# Altium project datn.PrjPCB
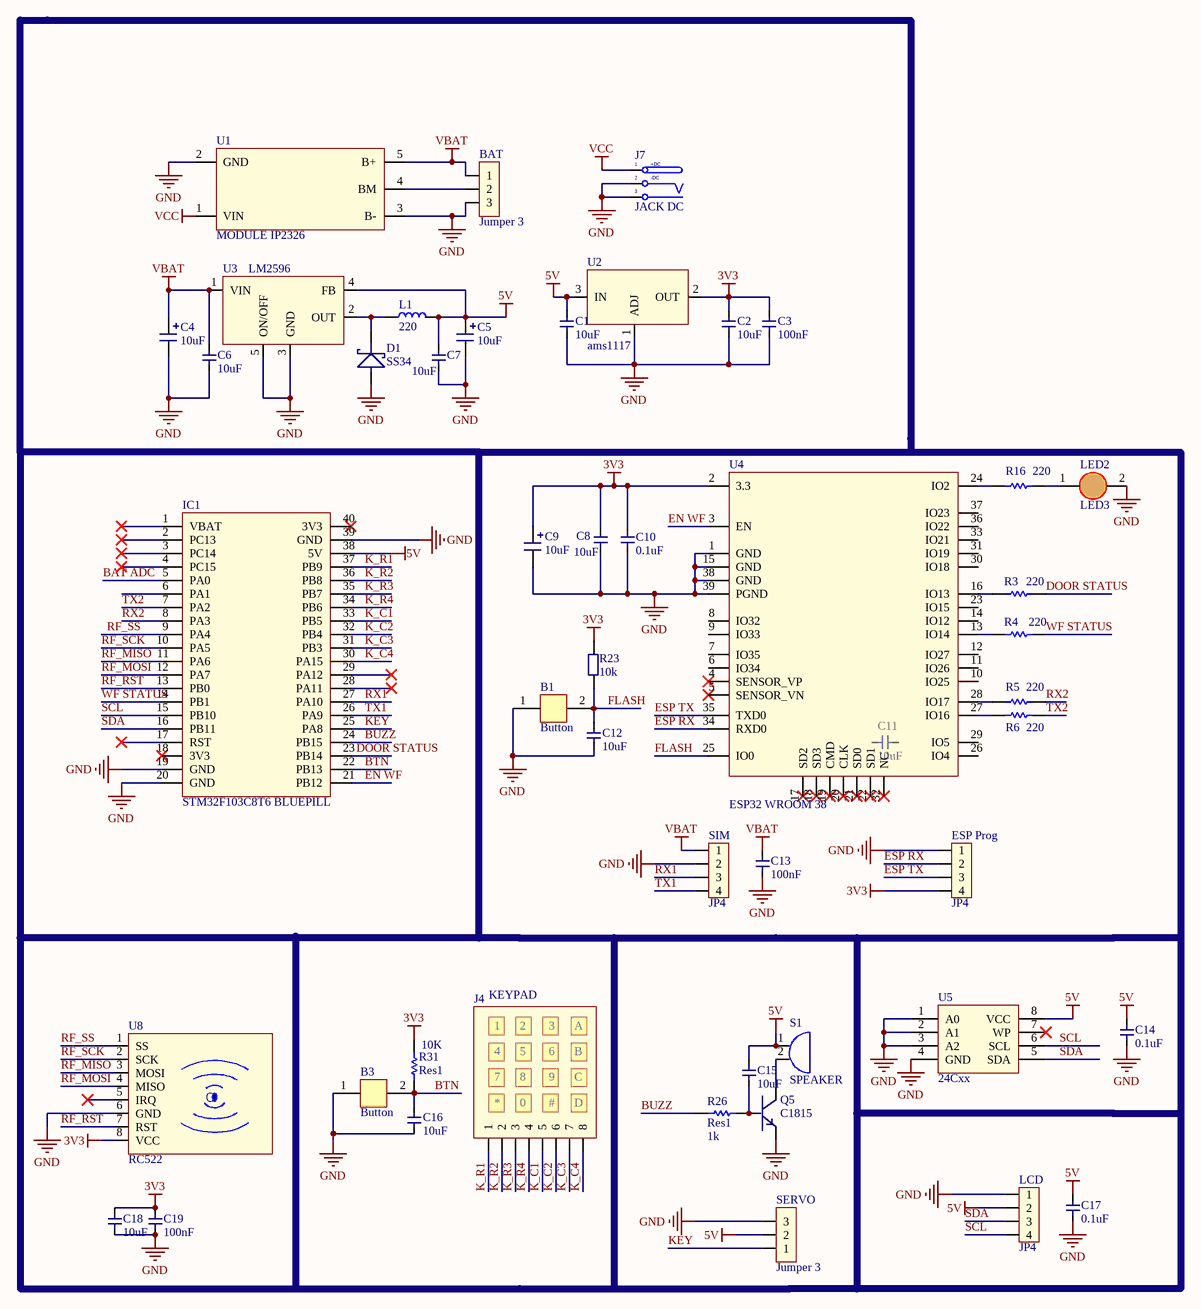
[diagram p0: nguyen_ly.SchDoc]
1 sheet, 48 parts. Net scope: global (net labels, ports and power ports of the same name join across sheets).
Board files: datn_pcb.PcbDoc, PCB1.PcbDoc, PCB2.PcbDoc

## Sheet nguyen_ly.SchDoc
size A3

### Parts
B1  Button  [Button 2 Pin]
B3  Button  [Button 2 Pin]
BAT  Jumper 3  [JP3]
C1  10uF  [cap 0805]
C2  10uF  [cap 0805]
C3  100nF  [cap 0805]
C4  10uF  [cap pol 63x54]
C5  10uF  [cap pol 63x54]
C6  10uF  [cap 0805]
C7  10uF  [cap 0805]
C8  10uF  [cap 0805]
C9  10uF  [cap pol 63x54]
C10  0.1uF  [cap 0805]
C11  10uF  [cap 0805]
C12  10uF  [cap 0805]
C13  100nF  [cap 0805]
C14  0.1uF  [cap 0805]
C15  10uF  [cap 0805]
C16  10uF  [cap 0805]
C17  0.1uF  [cap 0805]
C18  10uF  [cap 0805]
C19  100nF  [cap 0805]
D1  SS34  [Diode SS34]
ESP_Prog  JP4  [JP4]
IC1  STM32F103C8T6 BLUEPILL  [STM32 BLUEPILL]
J4  KEYPAD  [JP8]
J7  JACK DC  [JACK DC]
L1  220  [ind 74]
LCD  JP4  [JP4]
LED2  LED3  [LED3mm]
Q5  C1815  [Trans SOT23]
R3  value 220  [res 1/4w]
R4  value 220  [res 1/4w]
R5  value 220  [res 1/4w]
R6  value 220  [res 1/4w]
R16  value 220  [res 1/4w]
R23  10k  [Res 0805]
R26  Res1  value 1k  [res 1/4w]
R31  Res1  value 10K  [res 1/4w]
S1  SPEAKER  [SPEAKER]
SERVO  Jumper 3  [JP3]
SIM  JP4  [JP4]
U1  MODULE IP2326  [MACHSACPIN]
U2  ams1117  [ams1117 SOT223]
U3  LM2596  [LM2596]
U4  ESP32 WROOM 38  [ESP32 WROOM 38]
U5  24Cxx  [DIP8]
U8  RC522  [JP8]

### Nets
3V3: C2.2 C3.2 C8.2 C9.1 C10.2 C18.2 C19.2 ESP_Prog.4 R23.2 R31.1 U2.2(OUT) U4.2(3.3) U8.8(VCC)
5V: C1.2 C5.1 C7.2 C14.2 C15.2 C17.2 IC1.38(5V) L1.2 LCD.2 S1.1(A) SERVO.2 U2.3(IN) U3.4(FB) U5.8(VCC)
GND: B1.1 B3.1 BAT.3 C1.1 C2.1 C3.1 C4.2 C5.2 C6.1 C7.1 C8.1 C9.2 C10.1 C12.1 C13.1 C14.1 C16.1 C17.1 C18.1 C19.1 D1.1 ESP_Prog.1 IC1.19(GND) IC1.20(GND) IC1.39(GND) J7.2(TN) J7.3(S) LCD.1 LED2.2(K) Q5.2(E) SERVO.3 SIM.2 U1.2(GND) U1.3(B-) U2.1(ADJ) U3.3(GND) U3.5(ON/OFF) U4.1(GND) U4.15(GND) U4.38(GND) U4.39(PGND) U5.1(A0) U5.2(A1) U5.3(A2) U5.4(GND) U8.6(GND)
VBAT: BAT.1 C4.1 C6.2 C13.2 SIM.1 U1.5(B+) U3.1(VIN)
VCC: J7.1(T) U1.1(VIN)
BAT ADC: IC1.5(PA0)
BTN: B3.2 C16.2 IC1.22(PB13) R31.2
BUZZ: IC1.24(PB15) R26.1
DOOR STATUS: IC1.23(PB14) R3.1
EN WF: IC1.21(PB12) U4.3(EN)
ESP RX: ESP_Prog.2 U4.34(RXD0)
ESP TX: ESP_Prog.3 U4.35(TXD0)
FLASH: B1.2 C12.2 R23.1 U4.25(IO0)
K_C1: IC1.33(PB5) J4.5
K_C2: IC1.32(PB4) J4.6
K_C3: IC1.31(PB3) J4.7
K_C4: IC1.30(PA15) J4.8
K_R1: IC1.37(PB9) J4.1
K_R2: IC1.36(PB8) J4.2
K_R3: IC1.35(PB7) J4.3
K_R4: IC1.34(PB6) J4.4
KEY: IC1.25(PA8) SERVO.1
RF_MISO: IC1.11(PA6) U8.3(MOSI)
RF_MOSI: IC1.12(PA7) U8.4(MISO)
RF_RST: IC1.13(PB0) U8.7(RST)
RF_SCK: IC1.10(PA5) U8.2(SCK)
RF_SS: IC1.9(PA4) U8.1(SS)
RX1: IC1.27(PA10) SIM.3
RX2: IC1.8(PA3) R5.1
SCL: IC1.15(PB10) LCD.4 U5.6(SCL)
SDA: IC1.16(PB11) LCD.3 U5.5(SDA)
TX1: IC1.26(PA9) SIM.4
TX2: IC1.7(PA2) R6.1
WF STATUS: IC1.14(PB1) R4.1
NetBAT_2: BAT.2 U1.4(BM)
NetC15_1: C15.1 Q5.1(B) R26.2
NetD1_2: D1.2 L1.1 U3.2(OUT)
NetLED2_1: LED2.1(A) R16.1
NetQ5_3: Q5.3(C) S1.2(B)
NetR3_2: R3.2 U4.16(IO13)
NetR4_2: R4.2 U4.13(IO14)
NetR5_2: R5.2 U4.28(IO17)
NetR6_2: R6.2 U4.27(IO16)
NetR16_2: R16.2 U4.24(IO2)

Not connected (* = marked no-connect by the designer): C11 1 2; IC1 1(VBAT)* 2(PC13)* 3(PC14)* 4(PC15)* 6(PA1) 17(RST)* 18(3V3)* 28(PA11)* 29(PA12)* 40(3V3)*; U4 4(SENSOR_VP)* 5(SENSOR_VN)* 6(IO34) 7(IO35) 8(IO32) 9(IO33) 10(IO25) 11(IO26) 12(IO27) 14(IO12) 17(SD2)* 18(SD3)* 19(CMD)* 20(CLK)* 21(SD0)* 22(SD1)* 23(IO15) 26(IO4) 29(IO5) 30(IO18) 31(IO19) 32(NC)* 33(IO21) 36(IO22) 37(IO23); U5 7(WP)*; U8 5(IRQ)*

### Notes on the sheet
- (in symbol JACK DC) +DC; -DC
- (in symbol KEYPAD) A; B; 9; C; 0; #; D

### Library data of the parts
B1 B3 = Button 2 Pin
BAT SERVO = JP3: Value: J3
C1-C3 C6-C8 C10-C19 = cap
C4 C5 C9 = cap pol
L1 = INDUCTOR
LED2 = LED 3mm
Q5 = C1815 smd
R3-R6 R16 R26 R31 = Res1: Resistor; Published: 8-Jun-2000; LatestRevisionDate: 17-Jul-2002; LatestRevisionNote: Re-released for DXP Platform.; PackageReference: AXIAL-0.3; Publisher: Altium Limited
R23 = res
U1 = MACHSACPIN